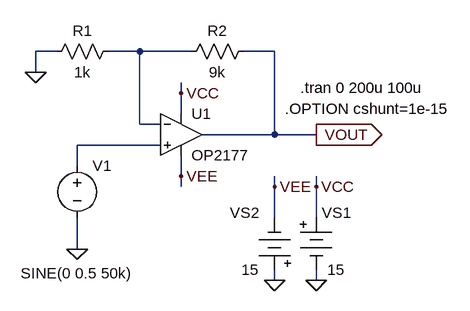
[diagram p0: schematic fig-02-02-12(a).asc]
fig-02-02-12(a).asc, the LTspice schematic file:
Version 4
SHEET 1 880 680
WIRE -32 64 -64 64
WIRE 96 64 48 64
WIRE 176 64 96 64
WIRE 304 64 256 64
WIRE -64 96 -64 64
WIRE 160 128 160 112
WIRE 160 160 160 128
WIRE 96 176 96 64
WIRE 128 176 96 176
WIRE 304 192 304 64
WIRE 304 192 192 192
WIRE 368 192 304 192
WIRE 128 208 0 208
WIRE 0 240 0 208
WIRE 160 256 160 224
WIRE 160 272 160 256
WIRE 304 272 304 256
WIRE 368 272 368 256
WIRE 304 320 304 272
WIRE 368 320 368 272
WIRE 0 368 0 320
WIRE 304 416 304 400
WIRE 368 416 368 400
FLAG 0 368 0
FLAG 368 192 VOUT
IOPIN 368 192 Out
FLAG 304 416 0
FLAG 368 416 0
FLAG 304 272 VEE
FLAG 368 272 VCC
FLAG 160 128 VCC
FLAG 160 256 VEE
FLAG -64 96 0
SYMBOL voltage 0 224 R0
WINDOW 3 -87 181 Left 2
WINDOW 123 41 56 Left 2
WINDOW 39 0 0 Left 2
SYMATTR Value SINE(0 0.5 50k)
SYMATTR InstName V1
SYMBOL OP2177 160 128 R0
SYMATTR InstName U1
SYMBOL res 272 48 R90
WINDOW 0 0 56 VBottom 2
WINDOW 3 32 56 VTop 2
SYMATTR InstName R2
SYMATTR Value 9k
SYMBOL res 64 48 R90
WINDOW 0 0 56 VBottom 2
WINDOW 3 32 56 VTop 2
SYMATTR InstName R1
SYMATTR Value 1k
SYMBOL Misc\\battery 368 304 R0
WINDOW 0 9 8 Left 2
WINDOW 3 17 96 Left 2
WINDOW 123 0 0 Left 0
WINDOW 39 0 0 Left 0
SYMATTR InstName VS1
SYMATTR Value 15
SYMBOL Misc\\battery 304 416 R180
WINDOW 0 24 104 Left 2
WINDOW 3 24 16 Left 2
WINDOW 123 0 0 Left 0
WINDOW 39 0 0 Left 0
SYMATTR InstName VS2
SYMATTR Value 15
TEXT 344 120 Left 2 !.tran 0 200u 100u
TEXT 320 152 Left 2 !.OPTION cshunt=1e-15

The netlist it stands for:
* fig-02-02-12(a).asc
V1 N002 0 SINE(0 0.5 50k)
* U1: OP2177 (symbol OP2177 not available, pins judged from their places): In+=N002 In-=N001 V+=VCC V-=VEE OUT=VOUT
R2 VOUT N001 9k
R1 N001 0 1k
VS1 VCC 0 15
VS2 0 VEE 15
.tran 0 200u 100u
.OPTION cshunt=1e-15
.backanno
.end